# Altium schematic sheet Battery_Charger_Schematic.SchDoc
size 381 x 241 mm; SheetNumber: 1; SheetTotal: 1
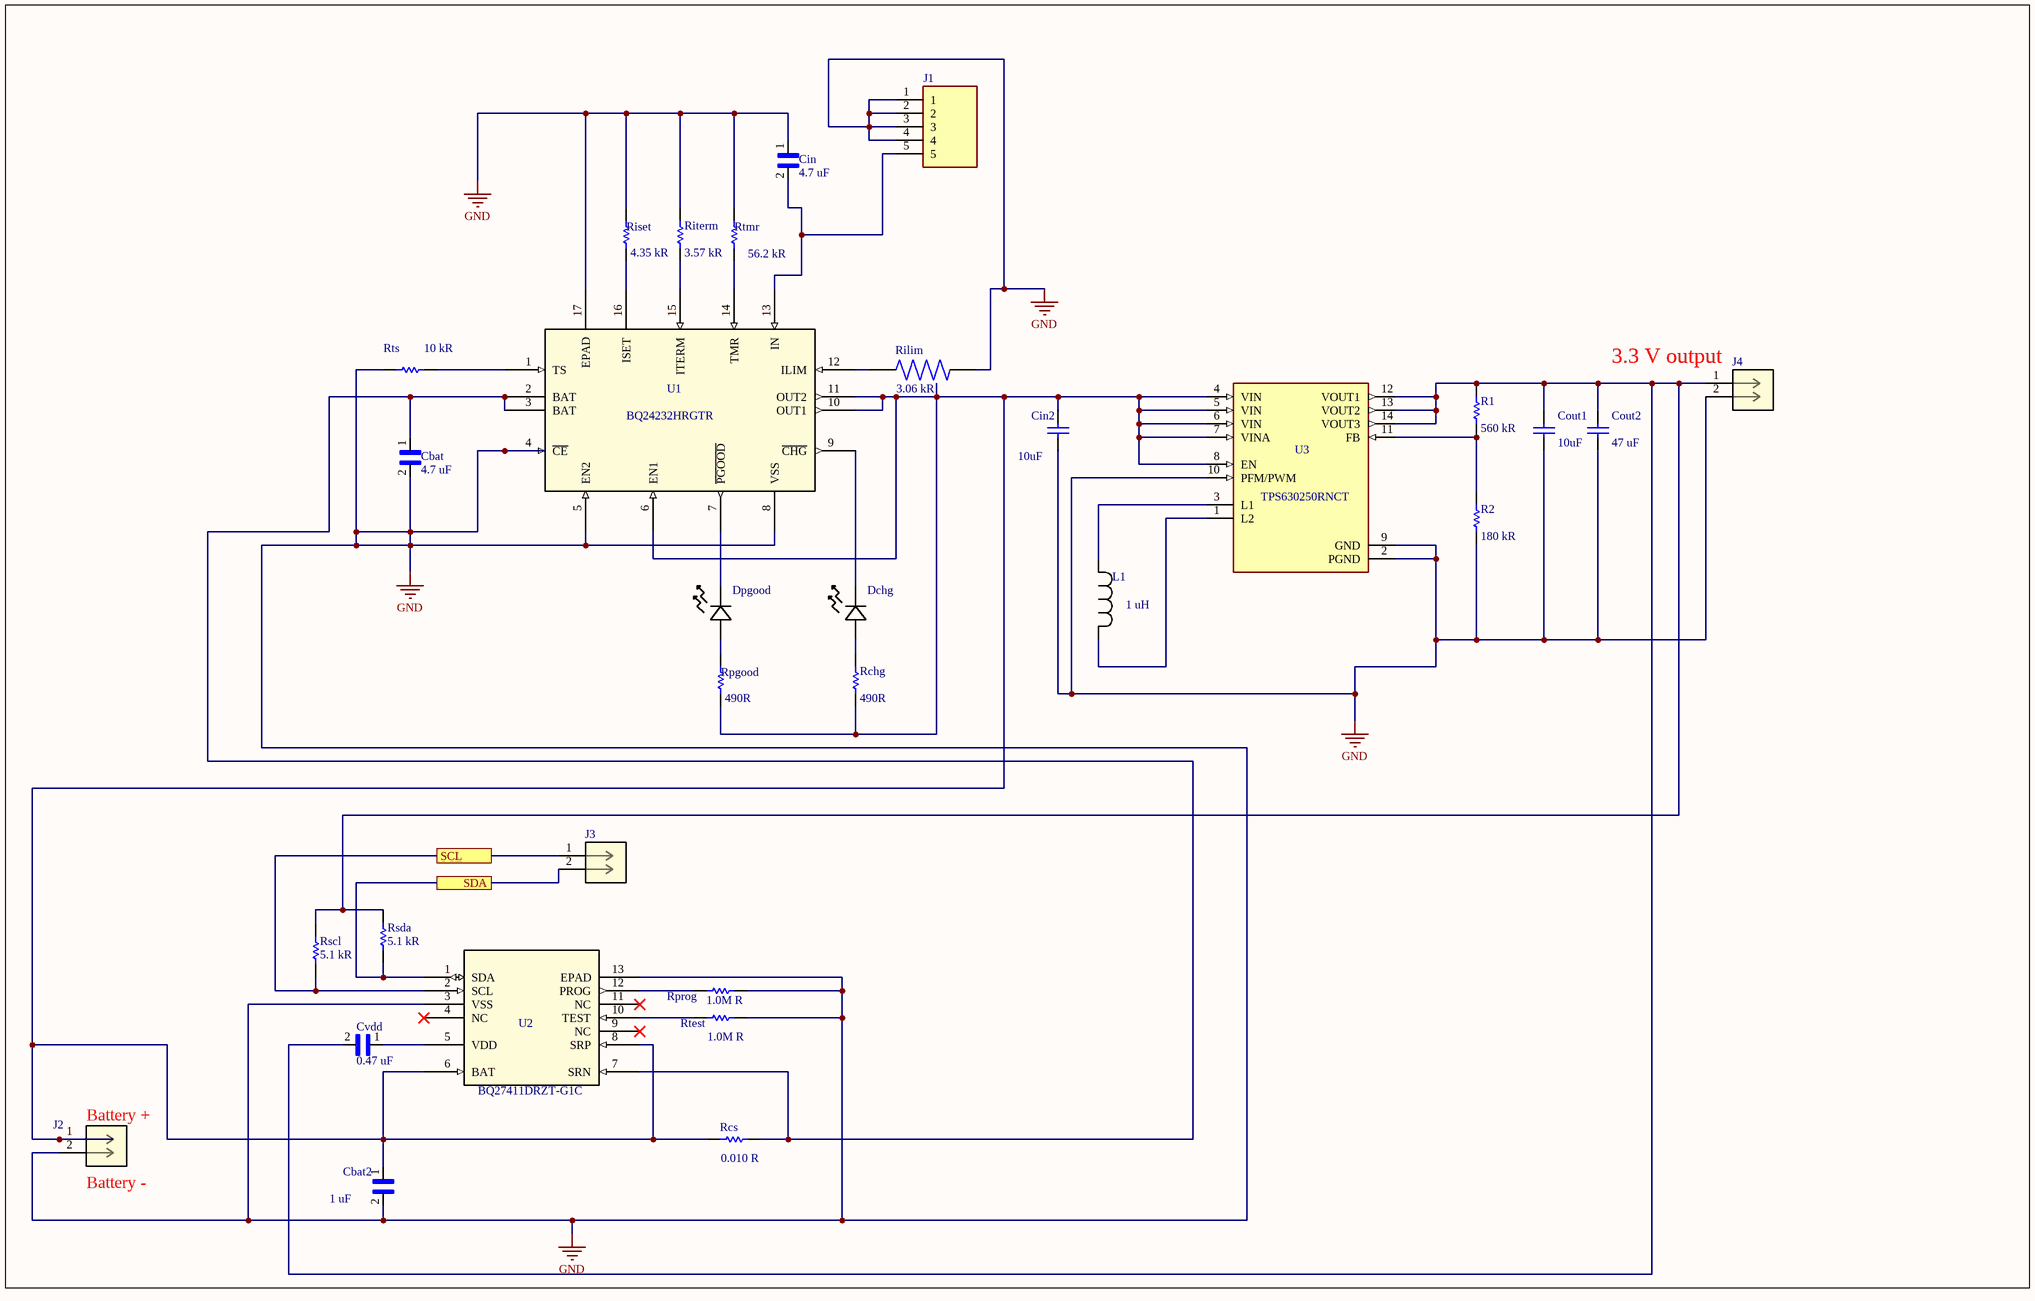
[diagram p0: Battery_Charger_Schematic.SchDoc]

## Parts
Cbat  4.7 uF  [CAP_RCER71H475K3K1H03B]
Cbat2  1 uF  [CAP_RCER71H475K3K1H03B]
Cin  4.7 uF  [CAP_RCER71H475K3K1H03B]
Cin2  value 10uF  [CAPC1608X95N]  (hidden comment: Cap)
Cout1  value 10uF  [CAPC1608X95N]  (hidden comment: Cap)
Cout2  value 47 uF  [CAPC1608X95N]  (hidden comment: Cap)
Cvdd  0.47 uF  [CAP_RCER71H475K3K1H03B]
Dchg  WP710A10-VN42  [LED_WP710A10_KNB]  (value not drawn)
Dpgood  WP710A10-VN42  [LED_WP710A10_KNB]  (value not drawn)
J1  87224-5  [TE_87224-5]  (value not drawn)
J2  BM02B-SRSS-TB (LF)(SN)  [CONN_BM02B-SRSS-TB_JST]  (value not drawn)
J3  77311-101-02LF  [77311-101-02LF_AMP]  (value not drawn)
J4  77311-101-02LF  [77311-101-02LF_AMP]  (value not drawn)
L1  1 uH  [IND_340068_WRE]
R1  value 560 kR  [RES_VISHAY_HVR25_VIS]  (hidden comment: Rchg)
R2  value 180 kR  [RES_VISHAY_HVR25_VIS]  (hidden comment: Rchg)
Rchg  value 490R  [RES_CMF07_VIS]  (hidden comment: Rchg)
Rcs  value 0.010 R  [RES_ERJ6CWFR010V]  (hidden comment: RJ2J3)
Rilim  3.06 kR  [RESC2012X60N]
Riset  value 4.35 kR  [AC03_VIS]  (hidden comment: Riset)
Riterm  value 3.57 kR  [RES_VISHAY_HVR25_VIS]  (hidden comment: Riterm)
Rpgood?  Rpgood  value 490R  [RES_CMF07_VIS]
Rprog  value 1.0M R  [RES_VISHAY_HVR25_VIS]  (hidden comment: Rprog)
Rscl  value 5.1 kR  [RES_VISHAY_HVR25_VIS]  (hidden comment: Rchg)
Rsda  value 5.1 kR  [RES_VISHAY_HVR25_VIS]  (hidden comment: Rchg)
Rtest  value 1.0M R  [RES_VISHAY_HVR25_VIS]  (hidden comment: Rtest)
Rtmr  value 56.2 kR  [RES_CMF60_VIS]  (hidden comment: Riset)
Rts  value 10 kR  [RES_VISHAY_HVR25_VIS]  (hidden comment: Rchg)
U1  BQ24232HRGTR  [QFN50P300X300X100-17N]
U2  BQ27411DRZT-G1C  [IC_BQ27441DRZR-G1A]
U3  TPS630250RNCT  [VREG_TPS630250RNCT]

## Ports
SCL, SDA

## Nets
GND: Cbat.2 Cbat2.2 Cin.1 Cin2.2 Cout1.2 Cout2.2 J1.1 J1.2 J1.3 J1.4 J2.2 J4.2 R2.2 Rilim.2 Riset.1 Riterm.1 Rprog.2 Rtest.2 Rtmr.1 Rts.1 U1.4(~{CE}) U1.5(EN2) U1.8(VSS) U1.17(EPAD) U2.3(VSS) U2.13(EPAD) U3.2(PGND) U3.9(GND) U3.10(PFM/PWM)
SCL: J3.1 Rscl.2 U2.2(SCL) ; port SCL
SDA: J3.2 Rsda.1 U2.1(SDA) ; port SDA
NetCbat2_1: Cbat2.1 Cin2.1 J2.1 Rchg.2 Rcs.1 Rpgood?.1 U1.6(EN1) U1.10(OUT1) U1.11(OUT2) U2.6(BAT) U2.8(SRP) U3.4(VIN) U3.5(VIN) U3.6(VIN) U3.7(VINA) U3.8(EN)
NetCbat_1: Cbat.1 Rcs.2 U1.2(BAT) U1.3(BAT) U2.7(SRN)
NetCin_2: Cin.2 J1.5 U1.13(IN)
NetCout1_1: Cout1.1 Cout2.1 Cvdd.2 J4.1 R1.1 Rscl.1 Rsda.2 U3.12(VOUT1) U3.13(VOUT2) U3.14(VOUT3)
NetCvdd_1: Cvdd.1 U2.5(VDD)
NetDchg_1: Dchg.1 U1.9(~{CHG})
NetDchg_2: Dchg.2 Rchg.1
NetDpgood_1: Dpgood.1 U1.7(~{PGOOD})
NetDpgood_2: Dpgood.2 Rpgood?.2
NetL1_1: L1.1 U3.1(L2)
NetL1_2: L1.2 U3.3(L1)
NetR1_2: R1.2 R2.1 U3.11(FB)
NetRilim_1: Rilim.1 U1.12(ILIM)
NetRiset_2: Riset.2 U1.16(ISET)
NetRiterm_2: Riterm.2 U1.15(ITERM)
NetRprog_1: Rprog.1 U2.12(PROG)
NetRtest_1: Rtest.1 U2.10(TEST)
NetRtmr_2: Rtmr.2 U1.14(TMR)
NetRts_2: Rts.2 U1.1(TS)

Not connected (* = marked no-connect by the designer): U2 4(NC)* 9(NC)* 11(NC)*

## Notes on the sheet
- (near J4) 3.3 V output
- (near J2) Battery +
- (near J2) Battery -

## Library data of the parts
Cbat Cin = RCER71H475K3K1H03B: Lead capacitor X7R(EIA) with Capacitance 4.7F, Rated Voltage 50Vdc; MF: Murata; Digi-Key_Part_Number: 490-11893-ND; Check_prices: https://www.snapeda.com/parts/RCER71H475K3K1H03B/Murata/view-part/?ref=eda; MP: RCER71H475K3K1H03B; Value: *; SnapEDA_Link: https://www.snapeda.com/parts/RCER71H475K3K1H03B/Murata/view-part/?ref=snap; Package: NONSTANDARD; Purchase-URL: https://pricing.snapeda.com/search/part/RCER71H475K3K1H03B/?ref=eda
Cbat2 Cvdd = RCER71H475K3K1H03B: K105K20X7RF5TH5; MF: Murata; Digi-Key_Part_Number: 490-11893-ND; Check_prices: https://www.snapeda.com/parts/RCER71H475K3K1H03B/Murata/view-part/?ref=eda; MP: RCER71H475K3K1H03B; Value: *; SnapEDA_Link: https://www.snapeda.com/parts/RCER71H475K3K1H03B/Murata/view-part/?ref=snap; Package: NONSTANDARD; Purchase-URL: https://pricing.snapeda.com/search/part/RCER71H475K3K1H03B/?ref=eda
Cin2 Cout1 Cout2 = Cap: Capacitor; Published: 8-Jun-2000; LatestRevisionDate: 17-Jul-2002; LatestRevisionNote: Re-released for DXP Platform.; PackageReference: RAD-0.3; Publisher: Altium Limited; PackageDescription: Radial Cap, Thru-Hole; 2 Leads; 0.3 in Pin Spacing
Dchg Dpgood = WP710A10-VN42: No Description Available; Mfr_Name: Kingbright; Copyright: Copyright (C) 2022 Ultra Librarian. All rights reserved.; Manufacturer_Part_Number: WP710A10-VN42; RefDes: RefDes; Type: DEV
J1 = 87224-5: Conn Unshrouded Header HDR 5 POS 2.54mm Solder ST Thru-Hole; Number_of_Positions: 5; MF: TE Connectivity; Product_Type: Connector; Centerline_Pitch: 2.54 mm[.1 in]; Price: None; SnapEDA_Link: https://www.snapeda.com/parts/87224-5/TE%20Connectivity%20AMP%20Connectors/view-part/1233389/?ref=snap; EU_RoHS_Compliance: Compliant; MP: 87224-5; Value: *; Availability: Good; Package: None; Purchase-URL: https://pricing.snapeda.com/search/part/87224-5/?ref=eda; Check_prices: https://www.snapeda.com/parts/87224-5/TE%20Connectivity%20AMP%20Connectors/view-part/1233389/?ref=eda
J2 = BM02B-SRSS-TB (LF)(SN): No Description Available; Mfr_Name: JST; Copyright: Copyright (C) 2022 Ultra Librarian. All rights reserved.; Manufacturer_Part_Number: BM02B-SRSS-TB (LF)(SN); Digi-Key_Part_Number_1: 455-1788-2-ND; Digi-Key_Part_Number_2: 455-1788-1-ND; Digi-Key_Part_Number_3: 455-1788-6-ND; RefDes: RefDes; Type: DEV
J3 J4 = 77311-101-02LF: No Description Available; Mfr_Name: Amphenol ICC; Copyright: Copyright (C) 2022 Ultra Librarian. All rights reserved.; Manufacturer_Part_Number: 77311-101-02LF; Digi-Key_Part_Number_1: 609-5674-ND; Digi-Key_Part_Number_2: 77311-101-02LF-ND; RefDes: RefDes; Type: DEV
L1 = 744383340068: Mfr_Name: Wurth Electronics; Type: DEV; Copyright: Copyright (C) 2022 Ultra Librarian. All rights reserved.; Manufacturer_Part_Number: 744383340068; Digi-Key_Part_Number_1: 732-4953-2-ND; Digi-Key_Part_Number_2: 732-4953-1-ND; Digi-Key_Part_Number_3: 732-4953-6-ND; RefDes: RefDes
R1 R2 Rchg Rcs Riset Riterm Rpgood? Rprog Rscl Rsda Rtest Rtmr Rts = Res1: Resistor; Published: 8-Jun-2000; LatestRevisionDate: 17-Jul-2002; LatestRevisionNote: Re-released for DXP Platform.; PackageReference: AXIAL-0.3; Publisher: Altium Limited; PackageDescription: Axial Device, Thru-Hole; 2 Leads; 0.3 in Pin Spacing
Rilim = RT0805BRD073K05L: RES SMD 3.05K OHM 0.1% 1/8W 0805 RT0805BRD073K05L; Package: None; Price: None; Value: *; MP: RT0805BRD073K05L; Availability: Unavailable
U1 = BQ24232HRGTR: No Description Available; Mfr_Name: Texas Instruments; Copyright: Copyright (C) 2021 Ultra Librarian. All rights reserved.; Manufacturer_Part_Number: BQ24232HRGTR; Digi-Key_Part_Number_1: 296-39912-1-ND; Digi-Key_Part_Number_2: 296-39912-2-ND; Digi-Key_Part_Number_3: 296-39912-6-ND; Digi-Key_Part_Number_4: BQ24232HRGTR-ND; RefDes: RefDes; Type: DEV
U2 = BQ27411DRZT-G1C: No Description Available; Mfr_Name: Texas Instruments; Copyright: Copyright (C) 2021 Ultra Librarian. All rights reserved.; Manufacturer_Part_Number: BQ27411DRZT-G1C; Digi-Key_Part_Number_1: 296-37270-1-ND; Digi-Key_Part_Number_2: 296-37270-2-ND; Digi-Key_Part_Number_3: 296-37270-6-ND; Digi-Key_Part_Number_4: 2156-BQ27411DRZT-G1C-ND; RefDes: RefDes; Type: DEV
U3 = TPS630250RNCT: Industrys Smallest 4A Switch Single-Inductor Buck-Boost Converter 14-VQFN-HR -40 to 85; MF: Texas Instruments; Purchase-URL: https://pricing.snapeda.com/search/part/TPS630250RNCT/?ref=eda; Price: None; SnapEDA_Link: https://www.snapeda.com/parts/TPS630250RNCT/Texas%20Instruments/view-part/543444/?ref=snap; Package: VQFN-HR-14 Texas Instruments; Availability: Warning; Value: *; MP: TPS630250RNCT; Check_prices: https://www.snapeda.com/parts/TPS630250RNCT/Texas%20Instruments/view-part/543444/?ref=eda